# Altium schematic sheet SBG.SchDoc
size A4; SheetNumber: 4; SheetTotal: 5
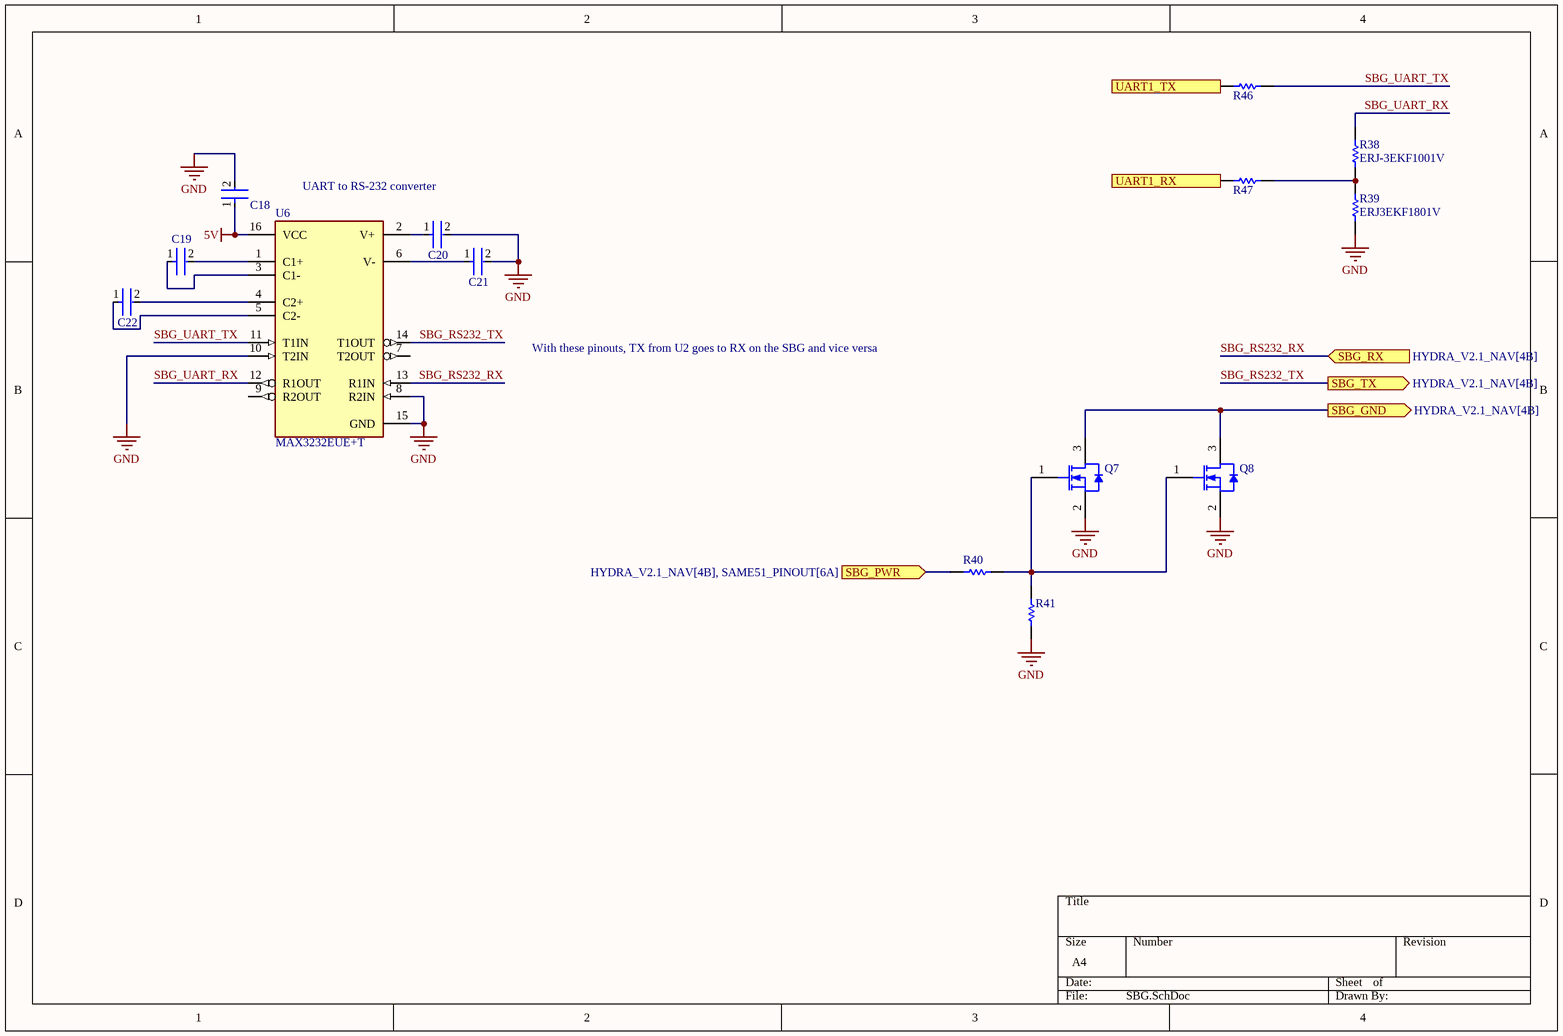
[diagram p0: SBG.SchDoc]

## Parts
C18  C0402C104K8PACTU  [FP-C0402-BB-MFG]  (value not drawn)
C19  C1005X5R1A475K050BC  [FP-C1005-050-0_15-MFG]  (value not drawn)
C20  C1005X5R1V334K050BC  [FP-C1005-050-0_05-IPC_B]  (value not drawn)
C21  C1005X5R1V334K050BC  [FP-C1005-050-0_05-IPC_B]  (value not drawn)
C22  C1005X5R1V334K050BC  [FP-C1005-050-0_05-IPC_B]  (value not drawn)
Q7  BSS138W-7-F  [DIOD-SOT323-3_V]  (value not drawn)
Q8  BSS138W-7-F  [DIOD-SOT323-3_V]  (value not drawn)
R38  ERJ-3EKF1001V  [RESC1608X55X30LL15T15]
R39  ERJ3EKF1801V  [RESC1608X55X30LL15T15]
R40  ERJ-3EKF1001V  [RESC1608X55X30LL15T15]  (value not drawn)
R41  ERJ3EKF1002V  [RESC1609X55X30LL15T15]  (value not drawn)
R46  0402 JUMPER 0 OHM  [RESC1005X40X25NL05T05]  (value not drawn)
R47  0402 JUMPER 0 OHM  [RESC1005X40X25NL05T05]  (value not drawn)
U6  MAX3232EUE+T  [FP-U16-1-MFG]

## Ports
SBG_GND (out, see HYDRA_V2.1_NAV[4B]), SBG_PWR (in, see HYDRA_V2.1_NAV[4B], SAME51_PINOUT[6A]), SBG_RX (in, see HYDRA_V2.1_NAV[4B]), SBG_TX (out, see HYDRA_V2.1_NAV[4B]), UART1_RX (out), UART1_TX (in)

## Nets
5V: C18.1 U6.16(VCC)
GND: C18.2 C20.2 C21.2 Q7.2(S) Q8.2(S) R39.1 R41.1 U6.8(R2IN) U6.10(T2IN) U6.15(GND)
SBG_GND: Q7.3(D) Q8.3(D) ; port SBG_GND
SBG_PWR: R40.1 ; port SBG_PWR
SBG_RS232_RX: U6.13(R1IN) ; port SBG_RX
SBG_RS232_TX: U6.14(T1OUT) ; port SBG_TX
SBG_UART_RX: R38.2 U6.12(R1OUT)
SBG_UART_TX: R46.2 U6.11(T1IN)
UART1_RX: R47.1 ; port UART1_RX
UART1_TX: R46.1 ; port UART1_TX
NetC19_1: C19.1 U6.3(C1-)
NetC19_2: C19.2 U6.1(C1+)
NetC20_1: C20.1 U6.2(V+)
NetC21_1: C21.1 U6.6(V-)
NetC22_1: C22.1 U6.5(C2-)
NetC22_2: C22.2 U6.4(C2+)
NetQ7_1: Q7.1(G) Q8.1(G) R40.2 R41.2
NetR38_1: R38.1 R39.2 R47.2

Not connected (* = marked no-connect by the designer): U6 7(T2OUT) 9(R2OUT)

## Notes on the sheet
- UART to RS-232 converter
- With these pinouts, TX from U2 goes to RX on the SBG and vice versa

## Library data of the parts
C18 = CMP-2008-02046-2: CAP CER 0.1UF 10V X5R 0402; Manufacturer: Kemet; Material: Ceramic; Capacitance: 0.10 μF; Temperature Coefficient: 15%; Tolerance: 0.1; Value: 0.10 μF; Package: C0402-BB; Temperature: -55°C to +125°C; ComponentLink2Description: Datasheet; Temperature Characteristic: X5R; Device Class L1: Passive Components; Height: 0.55mm; Lead Free: Yes; ComponentLink2URL: https://content.kemet.com/datasheets/KEM_C1002_X7R_SMD.pdf; Device Class L2: Capacitors; Temperature Range Low: -55°C; Temperature Range High: +125°C; RoHS: TRUE; Octopart: https://octopart.com/c0402c104k8pactu-kemet-140039; Automotive: No; Mouser Description: Capacitor 100 nF 10 VDC 0402; Category: Cap; Voltage Rating: 10 V; Digikey Description: CAP CER 0.1UF 10V X5R 0402; Ipc Land Pattern Name: CAPC10050X50; Device Class L3: Ceramic Capacitors; Manufacturer Part Number: C0402C104K8PACTU
C19 = CMP-2000-05997-2: CAP CER 4.7UF 10V X5R 0402; Dielectric Material: Ceramic; Tolerance: 10%; Series: C; Package Quantity: 10000; Max Operating Temperature: 85°C; Case Code (Imperial): 0402; Lead Free: Lead Free; Voltage Rating (DC): 10V; Packaging: Cut Tape; Voltage Rating: 10V; Min Operating Temperature: -55°C; Dielectric: X5R; Thickness: 0.022inch; Width: 0.02inch; Case/Package: 0402; Case Code (Metric): 1005; Capacitance: 4.7uF; Length: 0.039inch; RoHS Compliant: Yes; REACH SVHC: No SVHC; Mount: Surface Mount
C20-C22 = CMP-08246-005306-1: Multilayer Ceramic Capacitors 330nF ±10% 35V X5R SMD 0402; Dielectric: X5R; Case Code (Metric): 1005; Height: 0.5mm; Capacitance: 330nF; Max Operating Temperature: 85°C; Tolerance: 10%; Voltage Rating (DC): 35V; Voltage Rating: 35V; Lead Free: Lead Free; Mount: Surface Mount; Termination: SMD/SMT; Series: C; Dielectric Material: Ceramic; Thickness: 0.022inch; Length: 0.039inch; Package Quantity: 10000; Min Operating Temperature: -55°C; Case Code (Imperial): 0402; Packaging: Tape and Reel; RoHS Compliant: Yes; Width: 0.02inch; Weight: 2.3E-05oz; Case/Package: 0402
Q7 Q8 = CMP-2000-05968-1: N-Channel Enhancement Mode Mosfet, 50 V, 200 mA, -55 to 150 degC, 6-Pin SOT-323, RoHS, Tape and Reel; Typical Turn-Off Delay Time: 20ns; Number of Channels: 1Channel; Type: EnhancementModeFieldEffectTransistor; Brand: DiodesIncorporated; Vds - Drain-Source Breakdown Voltage: 75V; Vgs - Gate-Source Voltage: 20V; Rds On - Drain-Source Resistance: 1.4Ohms; Transistor Type: 1N-Channel; Configuration: Single; Unit Weight: 0.000212oz; Pd - Power Dissipation: 200mW; Id - Continuous Drain Current: 200mA; Forward Transconductance - Min: 0.1S; Manufacturer URL: http://www.diodes.com/; Series: BSS138; Package Description: 3-Pin Small Outline Transistor, Body 2 x 1.25 mm, Pitch 0.65 mm; Mounting Technology: SurfaceMount; Product Category: MOSFET; RoHS: True; Maximum Operating Temperature: +150C; Height: 1mm; Length: 2.2mm; Technology: Si; Width: 1.35mm; Datasheet URL: http://www.diodes.com/_files/datasheets/ds30206.pdf; Manufacturer: DiodesIncorporated; Package / Case: SOT-323-3; Typical Turn-On Delay Time: 20ns; Transistor Polarity: N-Channel; Factory Pack Quantity: 3000; Packaging: Reel; Product: MOSFETSmallSignal; Datasheet Version: Rev. 11-2, 09/2013; Package Reference: SOT323; Minimum Operating Temperature: -55C; Mounting Style: SMD/SMT; Channel Mode: Enhancement
R38 R40 = CMP-2000-00180-1: Manufacturer: Panasonic; Part Number: ERJ-3EKF1001V
R39 = CMP-2000-00294-1: Manufacturer: Panasonic; Part Number: ERJ3EKF1801V
R41 = CMP-1012-00623-3: Chip Resistor, 10 KOhm, +/- 1%, 0.1 W, -55 to 155 degC, 0603 (1608 Metric), RoHS, Tape and Reel; Manufacturer: Panasonic; Voltage Rating: 75V; Case\/Package: 0603; Power Rating: 100mW; Resistance: 10KOhm; Temperature Coefficient: 100ppm\/degreesC; Number of Pins: 2; Package Reference: 603; Depth: 0.8mm; Mount: SurfaceMount; Package Description: 2-Pin Surface Mount Device, Body 1.6 x 0.85 mm; Datasheet Version: 02/2017; Length: 1.6mm; Lead Free: LeadFree; Height: 0.45mm; Number of Terminations: 2; Max Power Dissipation: 100mW; Min Operating Temperature: -55degC; Datasheet URL: https://industrial.panasonic.com/cdbs/www-data/pdf/RDA0000/AOA0000C304.pdf; Termination: SMD/SMT; Case Code (Metric): 1608; Case Code (Imperial): 0603; Tolerance: 1%; Max Operating Temperature: 155degC; RoHSCompliant: true; Voltage Rating (DC): 75V; Radiation Hardening: No; Packaging: TapeandReel; Composition: ThickFilm; Mounting Technology: SurfaceMount; Manufacturer URL: http://www.panasonic.com/; Width: 0.031inch; REACH SVHC: NoSVHC; Contact Plating: Tin; Military Standard: Not; Package Quantity: 1
R46 R47 = CMP-009-00206-2: READ THE NAME
U6 = CMP-05679-000039-1: IC TXRX RS-232 LP 16-TSSOP; Manufacturer: Maxim Integrated; Standoff Height: 0.05mm; Nominal Supply Current: 0.3mA; Simplex Duplex: Full Duplex; Max Supply Voltage: 5.5V; Data Rate: 120kbits/s; Min Supply Voltage: 3V; Number Of Receivers: 2; RoHS: TRUE; Mouser Description: MAX3232 Series 235 kbps 5.5V Surface Mount RS-232 Transceiver - TSSOP-16; Category: IC; Manufacturer Part Number: MAX3232EUE+T; Footprint Url: https://pdfserv.maximintegrated.com/land_patterns/90-0117.PDF; Device Class L2: Interface ICs; Automotive: No; ComponentLink2Description: Datasheet; Device Class L3: RS-232 / RS-422 / RS-485 Interface ICs; Temperature Range High: +85°C; Package: U16-1; Lead Free: Yes; Digikey Description: IC TXRX RS-232 LP 16-TSSOP; ComponentLink2URL: https://datasheets.maximintegrated.com/en/ds/MAX3222-MAX3241.pdf; Temperature: -40°C to +85°C; Number Of Transmitters: 2; Height: 1.1mm; Octopart: https://octopart.com/max3232eue%2Bt-maxim+integrated-39814427; Device Class L1: Integrated Circuits (ICs); Interface: RS-232; Temperature Range Low: -40°C